# EAGLE schematic reflow (EAGLE 6.4)
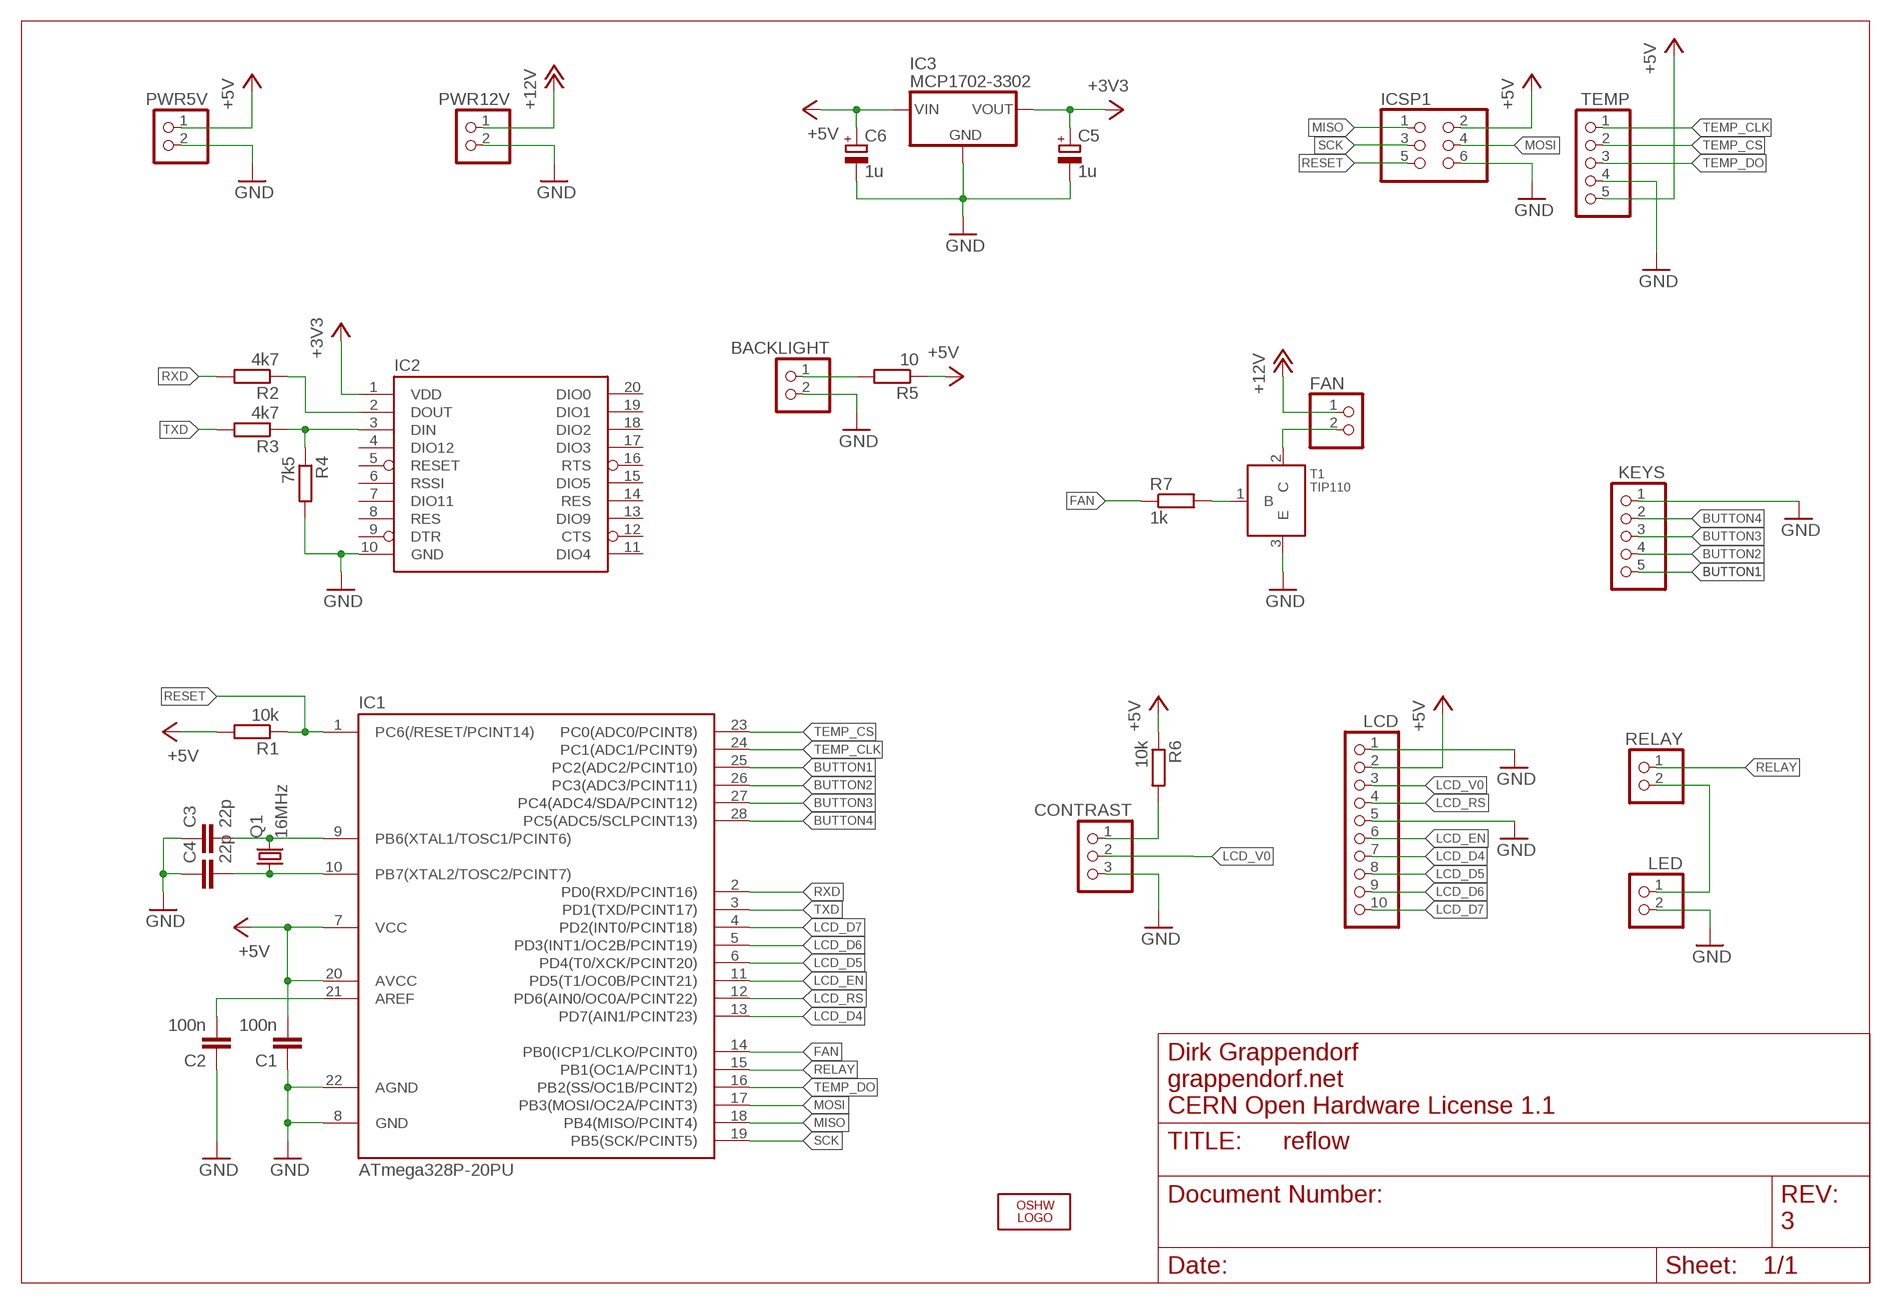
[diagram p0: schematic, sheet 1]

## Parts
BACKLIGHT  PINHD-1X2  [1X02]
C1  100n  C-EU025-024X044  [C025-024X044]
C2  100n  C-EU025-024X044  [C025-024X044]
C3  22p  C-EU025-025X050  [C025-025X050]
C4  22p  C-EU025-025X050  [C025-025X050]
C5  1u  CPOL-EUE2.5-5  [E2,5-5]
C6  1u  CPOL-EUE2.5-5  [E2,5-5]
CONTRAST  PINHD-1X3  [1X03]
FAN  PINHD-1X2  [1X02]
IC1  ATmega328P-20PU  ATMEGA48/88/168-PU  [DIL28-3]
IC2  XBEE-1B1  [XBEE-1]
IC3  MCP1702-3302  MCP1702  [MCP1702]
ICSP1  PINHD-2X03_2.54  [2X03]
KEYS  PINHD-1X5  [1X05]
LCD  PINHD-1X10  [1X10]
LED  PINHD-1X2  [1X02]
LOGO1  OSHW_LOGO_10MILX0350-NT-BOTTOM  [OSHW_10X350_NOTEXT_BOTTOM]
PWR5V  PINHD-1X2  [1X02]
PWR12V  PINHD-1X2  [1X02]
Q1  16MHz  CRYSTALHC49U-V  [HC49U-V]
R1  10k  R-EU_0204/7  [0204/7]
R2  4k7  R-EU_0204/7  [0204/7]
R3  4k7  R-EU_0204/7  [0204/7]
R4  7k5  R-EU_0204/7  [0204/7]
R5  10  R-EU_0204/7  [0204/7]
R6  10k  R-EU_0204/7  [0204/7]
R7  1k  R-EU_0204/7  [0204/7]
RELAY  PINHD-1X2  [1X02]
T1  TIP110  TIP112  [T0220]
TEMP  PINHD-1X5  [1X05]

## Nets
+3V3: C5.+ IC2.1(VDD) IC3.VOUT(OUT)
+5V: C1.2 C6.+ IC1.7(VCC) IC1.20(AVCC) IC3.VIN(IN) ICSP1.2 LCD.2 PWR5V.1 R1.2 R5.1 R6.1 TEMP.5
+12V: FAN.1 PWR12V.1
BUTTON1: IC1.25(PC2(ADC2/PCINT10)) KEYS.5
BUTTON2: IC1.26(PC3(ADC3/PCINT11)) KEYS.4
BUTTON3: IC1.27(PC4(ADC4/SDA/PCINT12)) KEYS.3
BUTTON4: IC1.28(PC5(ADC5/SCLPCINT13)) KEYS.2
FAN: IC1.14(PB0(ICP1/CLKO/PCINT0)) R7.1
GND: BACKLIGHT.2 C1.1 C2.1 C3.1 C4.1 C5.- C6.- CONTRAST.3 IC1.8(GND) IC1.22(AGND) IC2.10(GND) IC3.GND ICSP1.6 KEYS.1 LCD.1 LCD.5 LED.2 PWR5V.2 PWR12V.2 R4.2 T1.3(E) TEMP.4
LCD_D4: IC1.13(PD7(AIN1/PCINT23)) LCD.7
LCD_D5: IC1.6(PD4(T0/XCK/PCINT20)) LCD.8
LCD_D6: IC1.5(PD3(INT1/OC2B/PCINT19)) LCD.9
LCD_D7: IC1.4(PD2(INT0/PCINT18)) LCD.10
LCD_EN: IC1.11(PD5(T1/OC0B/PCINT21)) LCD.6
LCD_RS: IC1.12(PD6(AIN0/OC0A/PCINT22)) LCD.4
LCD_V0: CONTRAST.2 LCD.3
MISO: IC1.18(PB4(MISO/PCINT4)) ICSP1.1
MOSI: IC1.17(PB3(MOSI/OC2A/PCINT3)) ICSP1.4
N$1: C3.2 IC1.9(PB6(XTAL1/TOSC1/PCINT6)) Q1.2
N$2: C4.2 IC1.10(PB7(XTAL2/TOSC2/PCINT7)) Q1.1
N$3: C2.2 IC1.21(AREF)
N$4: IC2.3(DIN) R3.1 R4.1
N$5: IC2.2(DOUT) R2.1
N$6: BACKLIGHT.1 R5.2
N$7: LED.1 RELAY.2
N$8: CONTRAST.1 R6.2
N$9: FAN.2 T1.2(C)
N$10: R7.2 T1.1(B)
RELAY: IC1.15(PB1(OC1A/PCINT1)) RELAY.1
RESET: IC1.1(PC6(/RESET/PCINT14)) ICSP1.5 R1.1
RXD: IC1.2(PD0(RXD/PCINT16)) R2.2
SCK: IC1.19(PB5(SCK/PCINT5)) ICSP1.3
TEMP_CLK: IC1.24(PC1(ADC1/PCINT9)) TEMP.1
TEMP_CS: IC1.23(PC0(ADC0/PCINT8)) TEMP.2
TEMP_DO: IC1.16(PB2(SS/OC1B/PCINT2)) TEMP.3
TXD: IC1.3(PD1(TXD/PCINT17)) R3.2
Unconnected: IC2.4(DIO12) IC2.5(RESET) IC2.6(RSSI) IC2.7(DIO11) IC2.8(RES) IC2.9(DTR) IC2.11(DIO4) IC2.12(CTS) IC2.13(DIO9) IC2.14(RES) IC2.15(DIO5) IC2.16(RTS) IC2.17(DIO3) IC2.18(DIO2) IC2.19(DIO1) IC2.20(DIO0)

## Notes on the sheet
- Dirk Grappendorf
- grappendorf.net
- CERN Open Hardware License 1.1
- 3

## Library data of the parts
BACKLIGHT FAN LED PWR5V PWR12V RELAY = pinhead:PINHD-1X2: PIN HEADER
C1-C4 = rcl:C-EU: CAPACITOR, European symbol
C5 C6 = rcl:CPOL-EU: POLARIZED CAPACITOR, European symbol
CONTRAST = pinhead:PINHD-1X3: PIN HEADER
IC1 = atmega8:ATMEGA48/88/168-PU
IC2 = SparkFun:XBEE-1
IC3 = grapelabs:MCP1702: VOLTAGE REGULATOR
ICSP1 = pinhead-2:PINHD-2X03: PIN HEADER
KEYS TEMP = pinhead:PINHD-1X5: PIN HEADER
LCD = pinhead:PINHD-1X10: PIN HEADER
LOGO1 = OSHW:OSHW_LOGO_10MIL
Q1 = crystal:CRYSTAL: CRYSTAL
R1-R7 = rcl:R-EU_: RESISTOR, European symbol
T1 = tip112:TIP112

## Net classes
0 default: width 0.254 mm, drill 0.305 mm, clearance 0.152 mm
1 power: width 0.61 mm, drill 0.508 mm, clearance 0.152 mm
2 gnd: width 0.305 mm, drill 0.508 mm, clearance 0.152 mm
3 usbvcc: width 0.508 mm, drill 0.508 mm, clearance 0.152 mm
4 aref: width 0.406 mm